# Altium schematic sheet SX1255.SchDoc: SX1255
size A4; CompanyName: WiSE Lab; Engineer: Anh Luong; Organization: Carnegie Mellon University; Address1: 4720 Forbes Ave; Address2: CIC 2219F; Address3: Pittsburgh, PA 15213; Address4: USA; Revision: 1; SheetNumber: 3; SheetTotal: 4
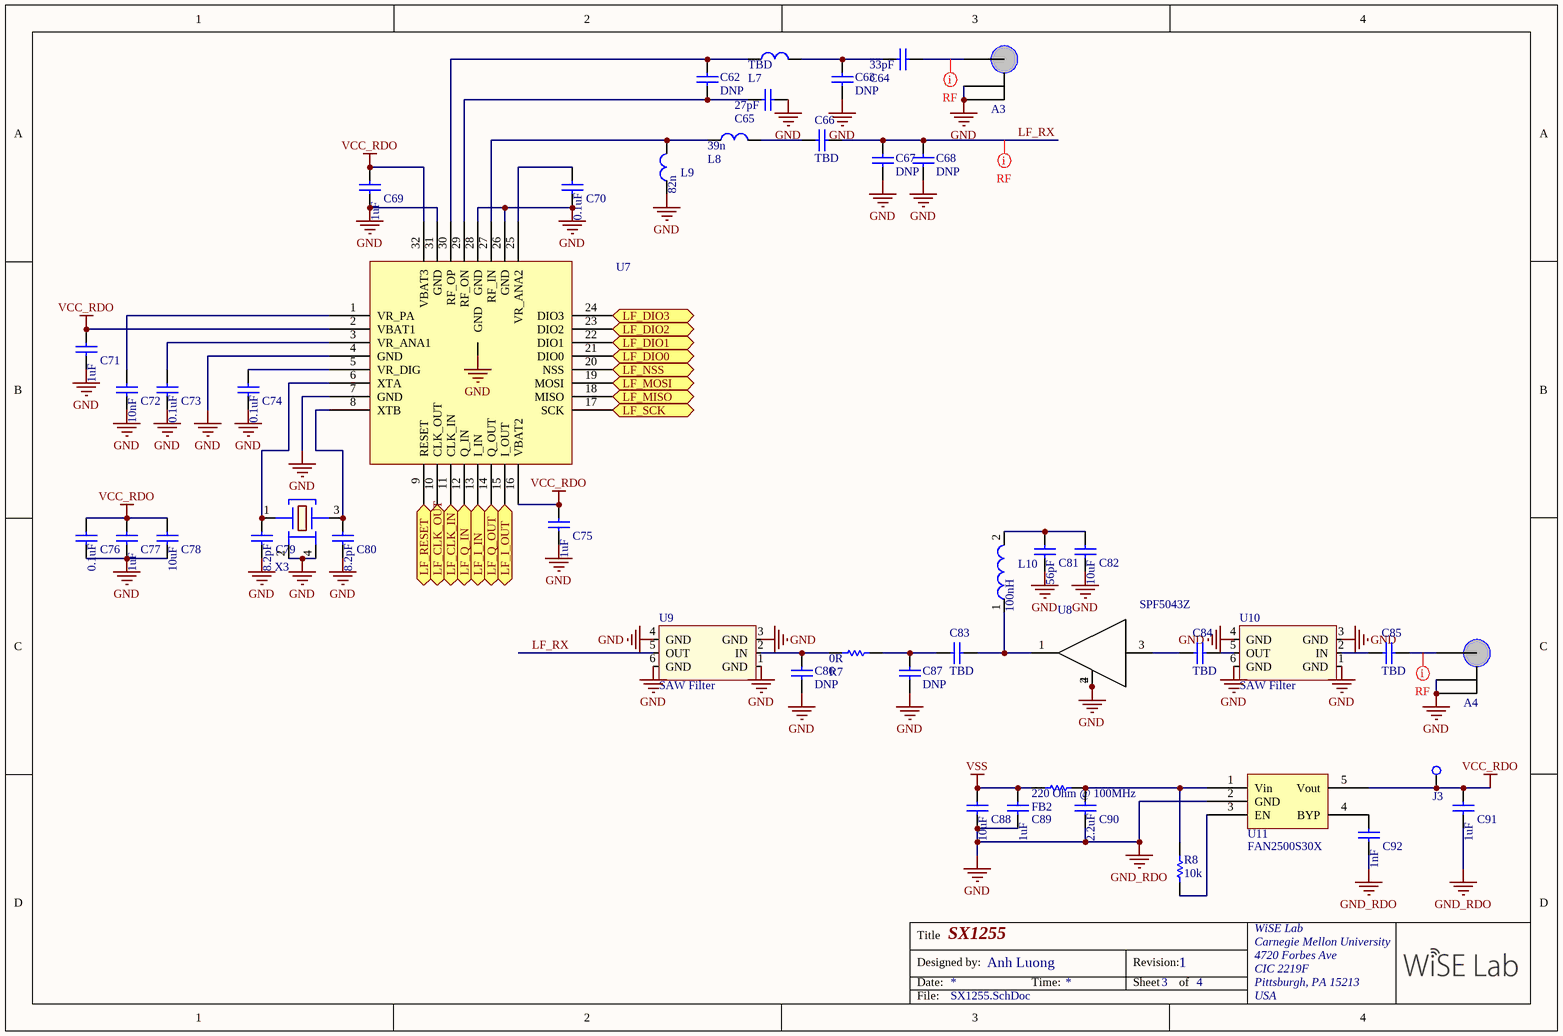
[diagram p0: SX1255.SchDoc]

## Parts
A3  U.FL-R-SMT(01)  [U.FL-R-SMT-1]  (value not drawn)
A4  U.FL-R-SMT(01)  [U.FL-R-SMT-1]  (value not drawn)
C62  value DNP  [CAPC1005X04L]  (hidden comment: C_DNP)
C63  value DNP  [CAPC1005X04L]  (hidden comment: C_DNP)
C64  GRM1555C1H330JA01D  [CAPC1005X04L]  (value not drawn)
C65  GRM1555C1H270JA01J  [CAPC1005X04L]  (value not drawn)
C66  value TBD  [CAPC1005X04L]  (hidden comment: C_TBD)
C67  value DNP  [CAPC1005X04L]  (hidden comment: C_DNP)
C68  value DNP  [CAPC1005X04L]  (hidden comment: C_DNP)
C69  GRM155R60J105KE19D  [CAPC1005X04L]  (value not drawn)
C70  GRM155R71C104KA88D  [CAPC1005X04L]  (value not drawn)
C71  GRM155R60J105KE19D  [CAPC1005X04L]  (value not drawn)
C72  GRM155R71E103KA01D  [CAPC1005X04L]  (value not drawn)
C73  GRM155R71C104KA88D  [CAPC1005X04L]  (value not drawn)
C74  GRM155R71C104KA88D  [CAPC1005X04L]  (value not drawn)
C75  GRM155R60J105KE19D  [CAPC1005X04L]  (value not drawn)
C76  GRM155R71C104KA88D  [CAPC1005X04L]  (value not drawn)
C77  GRM155R60J105KE19D  [CAPC1005X04L]  (value not drawn)
C78  GRM155R60J106ME15D  [INDC1005X04L]  (value not drawn)
C79  GRM1555C1H8R2CA01D  [CAPC1005X04L]  (value not drawn)
C80  GRM1555C1H8R2CA01D  [CAPC1005X04L]  (value not drawn)
C81  GRM1555C1H560JA01D  [CAPC1005X04L]  (value not drawn)
C82  GRM155R60J106ME15D  [INDC1005X04L]  (value not drawn)
C83  value TBD  [CAPC1005X04L]  (hidden comment: C_TBD)
C84  value TBD  [CAPC1005X04L]  (hidden comment: C_TBD)
C85  value TBD  [CAPC1005X04L]  (hidden comment: C_TBD)
C86  value DNP  [CAPC1005X04L]  (hidden comment: C_DNP)
C87  value DNP  [CAPC1005X04L]  (hidden comment: C_DNP)
C88  GRM188C81C106MA73D  [CAPC1608X08N (0603)]  (value not drawn)
C89  GRM188R61A105KA61D  [CAPC1608X08N (0603)]  (value not drawn)
C90  GRM188R60J225KE19D  [CAPC1608X08N (0603)]  (value not drawn)
C91  GRM188R61A105KA61D  [CAPC1608X08N (0603)]  (value not drawn)
C92  GRM1885C1H102JA01D  [CAPC1608X08N (0603)]  (value not drawn)
FB2  BLM18BD221SN1D  [RESC1608X06N (0603)]  (value not drawn)
J3  5004  [TP]  (value not drawn)
L7  L_TBD  [INDC1005X04L]  (value not drawn)
L8  LQG15HS39NJ02D  [INDC1005X04L]  (value not drawn)
L9  LQG15HS82NJ02D  [INDC1005X04L]  (value not drawn)
L10  LQG15HSR10J02D  [INDC1005X04L]  (value not drawn)
R7  PMR01ZZPJ000  [RESC1005X04N]  (value not drawn)
R8  value 10k  [RESC1608X06N (0603)]  (hidden comment: MCR03ERTF1002)
U7  SX1257IWLTRT  [QFN50P500X500X80_HS-33N]  (value not drawn)
U8  SPF5043Z  [SOT-343]
U9  SAW Filter  [DCC6C_3.0x3.0mm]
U10  SAW Filter  [DCC6C_3.0x3.0mm]
U11  FAN2500S30X  [SOT95P280X145-5N]
X3  ABM11-36.000MHZ-D2X-T3  [2.0x1.6x0.59mmXTAL]  (value not drawn)

## Ports
LF_CLK_IN, LF_CLK_OUT, LF_DIO0, LF_DIO1, LF_DIO2, LF_DIO3, LF_I_IN, LF_I_OUT, LF_MISO, LF_MOSI, LF_NSS, LF_Q_IN, LF_Q_OUT, LF_RESET, LF_SCK

## Nets
GND: A3.2 A3.3 A4.2 A4.3 C63.1 C65.2 C67.1 C68.1 C69.1 C70.1 C71.1 C72.1 C73.1 C74.1 C75.1 C76.1 C77.1 C78.1 C79.1 C80.1 C81.1 C82.1 C86.1 C87.1 C88.1 C89.1 C90.1 C91.1 C92.1 L9.1 U7.4(GND) U7.7(GND) U7.26(GND) U7.28(GND) U7.31(GND) U7.33(GND) U8.2(GND1) U8.4(GND2) U9.1(GND) U9.3(GND) U9.4(GND) U9.6(GND) U10.1(GND) U10.3(GND) U10.4(GND) U10.6(GND) U11.2(GND) X3.2 X3.4  [also labelled GND_RDO]
VCC_RDO: C69.2 C71.2 C75.2 C76.2 C77.2 C78.2 C91.2 J3.1 U7.2(VBAT1) U7.16(VBAT2) U7.32(VBAT3) U11.5(Vout)
VSS: C88.2 C89.2 FB2.1
LF_CLK_IN: U7.11(CLK_IN) ; port LF_CLK_IN
LF_CLK_OUT: U7.10(CLK_OUT) ; port LF_CLK_OUT
LF_DIO0: U7.21(DIO0) ; port LF_DIO0
LF_DIO1: U7.22(DIO1) ; port LF_DIO1
LF_DIO2: U7.23(DIO2) ; port LF_DIO2
LF_DIO3: U7.24(DIO3) ; port LF_DIO3
LF_I_IN: U7.13(I_IN) ; port LF_I_IN
LF_I_OUT: U7.15(I_OUT) ; port LF_I_OUT
LF_MISO: U7.18(MISO) ; port LF_MISO
LF_MOSI: U7.19(MOSI) ; port LF_MOSI
LF_NSS: U7.20(NSS) ; port LF_NSS
LF_Q_IN: U7.12(Q_IN) ; port LF_Q_IN
LF_Q_OUT: U7.14(Q_OUT) ; port LF_Q_OUT
LF_RESET: U7.9(RESET) ; port LF_RESET
LF_RX: C66.2 C67.2 C68.2 U9.5(OUT)
LF_SCK: U7.17(SCK) ; port LF_SCK
NetA3_1: A3.1 C64.2
NetA4_1: A4.1 C85.2
NetC62_1: C62.1 C65.1 U7.29(RF_ON)
NetC62_2: C62.2 L7.1 U7.30(RF_OP)
NetC63_2: C63.2 C64.1 L7.2
NetC66_1: C66.1 L8.2
NetC70_2: C70.2 U7.25(VR_ANA2)
NetC72_2: C72.2 U7.1(VR_PA)
NetC73_2: C73.2 U7.3(VR_ANA1)
NetC74_2: C74.2 U7.5(VR_DIG)
NetC79_2: C79.2 U7.6(XTA) X3.1
NetC80_2: C80.2 U7.8(XTB) X3.3
NetC81_2: C81.2 C82.2 L10.2
NetC83_1: C83.1 C87.2 R7.2
NetC83_2: C83.2 L10.1 U8.1(OUT)
NetC84_1: C84.1 U8.3(IN)
NetC84_2: C84.2 U10.5(OUT)
NetC85_1: C85.1 U10.2(IN)
NetC86_2: C86.2 R7.1 U9.2(IN)
NetC90_2: C90.2 FB2.2 R8.2 U11.1(Vin)
NetC92_2: C92.2 U11.4(BYP)
NetL8_1: L8.1 L9.2 U7.27(RF_IN)
NetR8_1: R8.1 U11.3(EN)

## Layout directives
net class RF: LF_RX, NetA3_1, NetA4_1

## Notes on the sheet
- Title
- Designed by:
- Date:
- Time:
- Revision:
- Sheet
- of
- File:
- (in symbol GRM155R60J105KE19D) 1uF
- (in symbol GRM155R60J106ME15D) 10uF
- (in symbol GRM155R71C104KA88D) 0.1uF
- (in symbol GRM155R71E103KA01D) 10nF
- (in symbol GRM188C81C106MA73D) 10uF
- (in symbol GRM188R60J225KE19D) 2.2uF
- (in symbol GRM188R61A105KA61D) 1uF
- (in symbol GRM1555C1H8R2CA01D) 8.2pF
- (in symbol GRM1555C1H270JA01J) 27pF
- (in symbol GRM1555C1H330JA01D) 33pF
- (in symbol GRM1555C1H560JA01D) 56pF
- (in symbol GRM1885C1H102JA01D) 1nF
- (in symbol L_TBD) TBD
- (in symbol LQG15HS39NJ02D) 39n
- (in symbol LQG15HS82NJ02D) 82n
- (in symbol LQG15HSR10J02D) 100nH
- (in symbol PMR01ZZPJ000) 0R

## Library data of the parts
A3 A4 = U.FL-R-SMT(01): CONN UMC JACK STR 50 OHM SMD; Manufacturer: Hirose Electric Co Ltd; Connector Style: Ultra Miniature Coaxial; Connector Type: Jack, Male Pin; Contact Termination: Solder; Impedance: 50 Ohm; Frequency - Max: 6GHz; Body Material: Phosphor Bronze; Body Finish: Silver; Center Contact Plating: Gold; Dielectric Material: Liquid Crystal Polymer (LCP); Supplier 1: Digi-Key; Manufacturer Part Number: U.FL-R-SMT(01); RoHS: RoHS Compliant; Category: Connectors, Interconnects; Stock 1: 22286; Pricing 1: 1=1.28, 10=1.122, 25=1.056, 50=1.012, 100=0.968, 250=0.88, 500=0.792, 1000=0.704, 2500=0.638 (USD); Packaging: Bulk; Shield Termination: Solder; Mounting Type: Surface Mount; Cable Group: -; Fastening Type: Snap-On; Features: -; Housing Color: Silver; Ingress Protection: -; Center Contact Material: Phosphor Bronze; Voltage Rating: -; Operating Temperature: -40°C ~ 90°C; ComponentLink1URL: http://www.hirose.co.jp/cataloge_hp/e32119372.pdf; ComponentLink1Description: http://www.hirose.co.jp/cataloge_hp/e32119372.pdf
C64 = GRM1555C1H330JA01D: CAP CER 33PF 50V C0G/NP0 0402; Manufacturer: Murata Electronics North America; Tolerance: ±5%; Temperature Coefficient: C0G, NP0; Supplier 1: Digi-Key; Manufacturer Part Number: GRM1555C1H330JA01D; RoHS: RoHS Compliant; Category: Capacitors; Stock 1: 295196; Pricing 1: 1=0.1, 10=0.015, 100=0.0067, 500=0.00478, 1000=0.00375, 2500=0.00341, 5000=0.00314 (USD); Packaging: Cut Tape (CT); Part Status: Active; Voltage - Rated: 50V; Operating Temperature: -55°C ~ 125°C; Features: -; Ratings: -; Applications: General Purpose; Mounting Type: Surface Mount, MLCC; Package / Case: 0402 (1005 Metric); Size / Dimension: 0.039" L x 0.020" W (1.00mm x 0.50mm); Height - Seated (Max): -; Thickness (Max): 0.022" (0.55mm); Lead Spacing: -; Lead Style: -; ComponentLink1URL: http://www.murata.com/~/media/webrenewal/support/library/catalog/products/capacitor/mlcc/c02e.pdf; ComponentLink1Description: http://www.murata.com/~/media/webrenewal/support/library/catalog/products/capacitor/mlcc/c02e.pdf; Supplier Part Number 1: 490-5936-1-ND
C65 = GRM1555C1H270JA01J: CAP CER 27PF 50V C0G/NP0 0402; Manufacturer: Murata Electronics North America; Tolerance: ±5%; Temperature Coefficient: C0G, NP0; Supplier 1: Digi-Key; Manufacturer Part Number: GRM1555C1H270JA01J; RoHS: RoHS Compliant; Category: Capacitors; Stock 1: 98162; Pricing 1: 1=0.1, 10=0.022, 100=0.0098, 500=0.00696, 1000=0.00548, 2500=0.00498, 5000=0.00458 (USD); Packaging: Cut Tape (CT); Part Status: Active; Voltage - Rated: 50V; Operating Temperature: -55°C ~ 125°C; Features: -; Ratings: -; Applications: General Purpose; Mounting Type: Surface Mount, MLCC; Package / Case: 0402 (1005 Metric); Size / Dimension: 0.039" L x 0.020" W (1.00mm x 0.50mm); Height - Seated (Max): -; Thickness (Max): 0.022" (0.55mm); Lead Spacing: -; Lead Style: -; ComponentLink1URL: http://www.murata.com/~/media/webrenewal/support/library/catalog/products/capacitor/mlcc/c02e.pdf; ComponentLink1Description: http://www.murata.com/~/media/webrenewal/support/library/catalog/products/capacitor/mlcc/c02e.pdf; Supplier Part Number 1: 490-11384-1-ND
C69 C71 C75 C77 = GRM155R60J105KE19D: CAP CER 1UF 6.3V X5R 0402; Manufacturer: Murata Electronics North America; Tolerance: ±10%; Supplier 1: Digi-Key; Manufacturer Part Number: GRM155R60J105KE19D; RoHS: RoHS Compliant; Category: Capacitors; Stock 1: 2790642; Pricing 1: 1=0.1, 10=0.024, 100=0.0108, 500=0.0077, 1000=0.00605, 2500=0.0055, 5000=0.00506 (USD); Packaging: Cut Tape (CT); Part Status: Active; Voltage - Rated: 6.3V; Temperature Coefficient: X5R; Operating Temperature: -55°C ~ 85°C; Features: -; Ratings: -; Applications: General Purpose; Mounting Type: Surface Mount, MLCC; Package / Case: 0402 (1005 Metric); Size / Dimension: 0.039" L x 0.020" W (1.00mm x 0.50mm); Height - Seated (Max): -; Thickness (Max): 0.022" (0.55mm); Lead Spacing: -; Lead Style: -; ComponentLink1URL: http://www.murata.com/~/media/webrenewal/support/library/catalog/products/capacitor/mlcc/c02e.pdf; ComponentLink1Description: http://www.murata.com/~/media/webrenewal/support/library/catalog/products/capacitor/mlcc/c02e.pdf; Supplier Part Number 1: 490-1320-1-ND
C70 C73 C74 C76 = GRM155R71C104KA88D: CAP CER 0.1UF 16V X7R 0402; Manufacturer: Murata Electronics North America; Tolerance: ±10%; Supplier 1: Digi-Key; Manufacturer Part Number: GRM155R71C104KA88D; RoHS: RoHS Compliant; Category: Capacitors; Stock 1: 38255872; Pricing 1: 1=0.1, 10=0.014, 100=0.0062, 500=0.00442, 1000=0.00348, 2500=0.00316, 5000=0.00291 (USD); Packaging: Cut Tape (CT); Part Status: Active; Voltage - Rated: 16V; Temperature Coefficient: X7R; Operating Temperature: -55°C ~ 125°C; Features: -; Ratings: -; Applications: General Purpose; Mounting Type: Surface Mount, MLCC; Package / Case: 0402 (1005 Metric); Size / Dimension: 0.039" L x 0.020" W (1.00mm x 0.50mm); Height - Seated (Max): -; Thickness (Max): 0.022" (0.55mm); Lead Spacing: -; Lead Style: -; ComponentLink1URL: http://www.murata.com/~/media/webrenewal/support/library/catalog/products/capacitor/mlcc/c02e.pdf; ComponentLink1Description: http://www.murata.com/~/media/webrenewal/support/library/catalog/products/capacitor/mlcc/c02e.pdf; Supplier Part Number 1: 490-3261-1-ND
C72 = GRM155R71E103KA01D: CAP CER 10000PF 25V X7R 0402; Manufacturer: Murata Electronics North America; Tolerance: ±10%; Supplier 1: Digi-Key; Manufacturer Part Number: GRM155R71E103KA01D; RoHS: RoHS Compliant; Category: Capacitors; Stock 1: 8083248; Pricing 1: 1=0.1, 10=0.013, 100=0.0056, 500=0.004, 1000=0.00315, 2500=0.00286, 5000=0.00263 (USD); Packaging: Cut Tape (CT); Part Status: Active; Voltage - Rated: 25V; Temperature Coefficient: X7R; Operating Temperature: -55°C ~ 125°C; Features: -; Ratings: -; Applications: General Purpose; Mounting Type: Surface Mount, MLCC; Package / Case: 0402 (1005 Metric); Size / Dimension: 0.039" L x 0.020" W (1.00mm x 0.50mm); Height - Seated (Max): -; Thickness (Max): 0.022" (0.55mm); Lead Spacing: -; Lead Style: -; ComponentLink1URL: http://www.murata.com/~/media/webrenewal/support/library/catalog/products/capacitor/mlcc/c02e.pdf; ComponentLink1Description: http://www.murata.com/~/media/webrenewal/support/library/catalog/products/capacitor/mlcc/c02e.pdf; Supplier Part Number 1: 490-1312-1-ND
C78 C82 = GRM155R60J106ME15D: CAP CER 10UF 6.3V X5R 0402; Manufacturer: Murata Electronics North America; Tolerance: ±20%; Supplier 1: Digi-Key; Manufacturer Part Number: GRM155R60J106ME15D; RoHS: RoHS Compliant; Category: Capacitors; Stock 1: 183912; Pricing 1: 1=0.24, 10=0.16, 100=0.0813, 500=0.0556, 1000=0.04918, 2500=0.04704, 5000=0.04277 (USD); Packaging: Cut Tape (CT); Part Status: Active; Voltage - Rated: 6.3V; Temperature Coefficient: X5R; Operating Temperature: -55°C ~ 85°C; Features: Derating Recommended; Ratings: -; Applications: General Purpose; Mounting Type: Surface Mount, MLCC; Package / Case: 0402 (1005 Metric); Size / Dimension: 0.039" L x 0.020" W (1.00mm x 0.50mm); Height - Seated (Max): -; Thickness (Max): 0.026" (0.65mm); Lead Spacing: -; Lead Style: -; ComponentLink1URL: http://www.murata.com/~/media/webrenewal/support/library/catalog/products/capacitor/mlcc/c02e.pdf; ComponentLink1Description: http://www.murata.com/~/media/webrenewal/support/library/catalog/products/capacitor/mlcc/c02e.pdf; Supplier Part Number 1: 490-13238-1-ND
C79 C80 = GRM1555C1H8R2CA01D: CAP CER 8.2PF 50V C0G/NP0 0402; Manufacturer: Murata Electronics North America; Tolerance: ±0.25pF; Temperature Coefficient: C0G, NP0; Supplier 1: Digi-Key; Manufacturer Part Number: GRM1555C1H8R2CA01D; RoHS: RoHS Compliant; Category: Capacitors; Stock 1: 757168; Pricing 1: 1=0.1, 10=0.032, 100=0.0143, 500=0.0102, 1000=0.00802, 2500=0.00729, 5000=0.0067 (USD); Packaging: Cut Tape (CT); Part Status: Active; Voltage - Rated: 50V; Operating Temperature: -55°C ~ 125°C; Features: -; Ratings: -; Applications: General Purpose; Mounting Type: Surface Mount, MLCC; Package / Case: 0402 (1005 Metric); Size / Dimension: 0.039" L x 0.020" W (1.00mm x 0.50mm); Height - Seated (Max): -; Thickness (Max): 0.022" (0.55mm); Lead Spacing: -; Lead Style: -; ComponentLink1URL: http://www.murata.com/~/media/webrenewal/support/library/catalog/products/capacitor/mlcc/c02e.pdf; ComponentLink1Description: http://www.murata.com/~/media/webrenewal/support/library/catalog/products/capacitor/mlcc/c02e.pdf; Supplier Part Number 1: 490-6256-1-ND
C81 = GRM1555C1H560JA01D: CAP CER 56PF 50V C0G/NP0 0402; Manufacturer: Murata Electronics North America; Tolerance: ±5%; Temperature Coefficient: C0G, NP0; Supplier 1: Digi-Key; Manufacturer Part Number: GRM1555C1H560JA01D; RoHS: RoHS Compliant; Category: Capacitors; Stock 1: 623532; Pricing 1: 1=0.1, 10=0.014, 100=0.0062, 500=0.00442, 1000=0.00348, 2500=0.00316, 5000=0.00291 (USD); Packaging: Cut Tape (CT); Part Status: Active; Voltage - Rated: 50V; Operating Temperature: -55°C ~ 125°C; Features: -; Ratings: -; Applications: General Purpose; Mounting Type: Surface Mount, MLCC; Package / Case: 0402 (1005 Metric); Size / Dimension: 0.039" L x 0.020" W (1.00mm x 0.50mm); Height - Seated (Max): -; Thickness (Max): 0.022" (0.55mm); Lead Spacing: -; Lead Style: -; ComponentLink1URL: http://www.murata.com/~/media/webrenewal/support/library/catalog/products/capacitor/mlcc/c02e.ashx?la=en-us; ComponentLink1Description: http://www.murata.com/~/media/webrenewal/support/library/catalog/products/capacitor/mlcc/c02e.ashx?la=en-us; Supplier Part Number 1: 490-1288-1-ND
C88 = GRM188C81C106MA73D: CAP CER 10UF 16V 20% X6S 0603; Manufacturer: Murata Electronics North America; Capacitance: 10µF; Supplier 1: Digi-Key; Manufacturer Part Number: GRM188C81C106MA73D; RoHS: RoHS Compliant; Category: Capacitors; Stock 1: 59274; Pricing 1: 1=0.4, 10=0.349, 50=0.2118, 100=0.1744, 250=0.13952, 500=0.12708, 1000=0.11237 (USD); Packaging: Cut Tape (CT); Voltage - Rated: 16V; Tolerance: ±20%; Temperature Coefficient: X6S; Mounting Type: Surface Mount, MLCC; Operating Temperature: -55°C ~ 105°C; Applications: General Purpose; Ratings: -; Package / Case: 0603 (1608 Metric); Size / Dimension: 0.063" L x 0.031" W (1.60mm x 0.80mm); Height - Seated (Max): -; Thickness (Max): 0.031" (0.80mm); Lead Spacing: -; Features: -; Lead Style: -; ComponentLink1URL: http://www.murata.com/products/catalog/pdf/c02e.pdf; ComponentLink1Description: http://www.murata.com/products/catalog/pdf/c02e.pdf
C89 C91 = GRM188R61A105KA61D: CAP CER 1UF 10V 10% X5R 0603; Manufacturer: Murata Electronics North America; Capacitance: 1.0µF; Supplier 1: Digi-Key; Manufacturer Part Number: GRM188R61A105KA61D; RoHS: RoHS Compliant; Category: Capacitors; Stock 1: 244919; Pricing 1: 1=0.1, 10=0.041, 50=0.0224, 100=0.019, 250=0.01552, 500=0.01328, 1000=0.01035 (USD); Packaging: Cut Tape (CT); Voltage - Rated: 10V; Tolerance: ±10%; Temperature Coefficient: X5R; Mounting Type: Surface Mount, MLCC; Operating Temperature: -55°C ~ 85°C; Applications: General Purpose; Ratings: -; Package / Case: 0603 (1608 Metric); Size / Dimension: 0.063" L x 0.031" W (1.60mm x 0.80mm); Height - Seated (Max): -; Thickness (Max): 0.035" (0.90mm); Lead Spacing: -; Features: -; Lead Style: -; ComponentLink1URL: http://search.murata.co.jp/Ceramy/image/img/A01X/G101/ENG/GRM188R61A105KA61-01.pdf; ComponentLink1Description: http://search.murata.co.jp/Ceramy/image/img/A01X/G101/ENG/GRM188R61A105KA61-01.pdf
C90 = GRM188R60J225KE19D: CAP CER 2.2UF 6.3V 10% X5R 0603; Manufacturer: Murata Electronics North America; Capacitance: 2.2µF; Supplier 1: Digi-Key; Manufacturer Part Number: GRM188R60J225KE19D; RoHS: RoHS Compliant; Category: Capacitors; Stock 1: 155330; Pricing 1: 1=0.17, 10=0.114, 50=0.0658, 100=0.0543, 250=0.04572, 500=0.0383, 1000=0.03143 (USD); Packaging: Cut Tape (CT); Voltage - Rated: 6.3V; Tolerance: ±10%; Temperature Coefficient: X5R; Mounting Type: Surface Mount, MLCC; Operating Temperature: -55°C ~ 85°C; Applications: General Purpose; Ratings: -; Package / Case: 0603 (1608 Metric); Size / Dimension: 0.063" L x 0.031" W (1.60mm x 0.80mm); Height - Seated (Max): -; Thickness (Max): 0.035" (0.90mm); Lead Spacing: -; Features: -; Lead Style: -; ComponentLink1URL: http://search.murata.co.jp/Ceramy/image/img/A01X/G101/ENG/GRM188R60J225KE19-01.pdf; ComponentLink1Description: http://search.murata.co.jp/Ceramy/image/img/A01X/G101/ENG/GRM188R60J225KE19-01.pdf
C92 = GRM1885C1H102JA01D: CAP CER 1000PF 50V 5% NP0 0603; Manufacturer: Murata Electronics North America; Temperature Coefficient: C0G, NP0; Supplier 1: Digi-Key; Manufacturer Part Number: GRM1885C1H102JA01D; RoHS: RoHS Compliant; Category: Capacitors; Stock 1: 140000; Pricing 1: 4000=0.00863, 8000=0.00788, 12000=0.0075, 28000=0.00713, 100000=0.00516 (USD); Packaging: Tape & Reel (TR); Capacitance: 1000pF; Voltage - Rated: 50V; Tolerance: ±5%; Mounting Type: Surface Mount, MLCC; Operating Temperature: -55°C ~ 125°C; Applications: General Purpose; Ratings: -; Package / Case: 0603 (1608 Metric); Size / Dimension: 0.063" L x 0.031" W (1.60mm x 0.80mm); Height - Seated (Max): -; Thickness (Max): 0.035" (0.90mm); Lead Spacing: -; Features: -; Lead Style: -; ComponentLink1URL: http://www.murata.com/products/catalog/pdf/c02e.pdf; ComponentLink1Description: http://www.murata.com/products/catalog/pdf/c02e.pdf
FB2 = BLM18BD221SN1D: FERRITE CHIP 220 OHM 200MA 0603; Manufacturer: Murata Electronics North America; Impedance @ Frequency: 220 Ohm @ 100MHz; DC Resistance (DCR): 450 mOhm Max; Filter Type: Differential Mode - Single; Supplier 1: Digi-Key; Manufacturer Part Number: BLM18BD221SN1D; RoHS: RoHS Compliant; Category: Filters; Stock 1: 35645; Pricing 1: 1=0.1, 10=0.087, 50=0.0712, 100=0.0523, 250=0.038, 500=0.03484, 1000=0.0301 (USD); Packaging: Cut Tape (CT); Current Rating: 200mA; Package / Case: 0603 (1608 Metric); Mounting Type: Surface Mount; Height (Max): 0.037" (0.95mm); Size / Dimension: 0.063" L x 0.031" W (1.60mm x 0.80mm); ComponentLink1URL: http://search.murata.co.jp/Ceramy/image/img/PDF/ENG/L0110S0100BLM18B.pdf; ComponentLink1Description: http://search.murata.co.jp/Ceramy/image/img/PDF/ENG/L0110S0100BLM18B.pdf
J3 = 5004: TEST POINT PC MINI .040"D YELLOW; Manufacturer: Keystone Electronics; Supplier 1: Digi-Key; Manufacturer Part Number: 5004; RoHS: RoHS Compliant; Category: Test and Measurement; Stock 1: 45761; Pricing 1: 1=0.34, 10=0.318, 50=0.232, 100=0.2228, 250=0.20008, 500=0.191, 1000=0.15916, 2500=0.14552, 5000=0.13643 (USD); Packaging: Bulk; Type: PC Test Point, Miniature; Terminal: 0.010" x 0.020" (0.25mm x 0.51mm) Phosphor Bronze Wire, Silver Plated; Mounting Type: 0.040" (1.02mm) Hole Diameter; Material: Base, Nylon 46, UL 94V-0; Color: Yellow; ComponentLink1URL: http://www.keyelco.com/product-pdf.cfm?p=1313; ComponentLink1Description: http://www.keyelco.com/product-pdf.cfm?p=1313
L8 = LQG15HS39NJ02D: FIXED IND 39NH 300MA 650 MOHM; Manufacturer: Murata Electronics North America; Type: Multilayer; Tolerance: ±5%; Shielding: Unshielded; DC Resistance (DCR): 650 mOhm Max; Q @ Freq: 8 @ 100MHz; Supplier 1: Digi-Key; Manufacturer Part Number: LQG15HS39NJ02D; RoHS: RoHS Compliant; Category: Inductors, Coils, Chokes; Stock 1: 33416; Pricing 1: 1=0.1, 10=0.066, 100=0.0442, 500=0.0368, 1000=0.03091, 2500=0.0265 (USD); Packaging: Cut Tape (CT); Part Status: Active; Material - Core: -; Ratings: -; Operating Temperature: -55°C ~ 125°C; Mounting Type: Surface Mount; Package / Case: 0402 (1005 Metric); Supplier Device Package: 0402 (1005 Metric); Size / Dimension: 0.039" L x 0.020" W (1.00mm x 0.50mm); Height - Seated (Max): 0.022" (0.55mm); ComponentLink1URL: http://search.murata.co.jp/Ceramy/image/img/P02/JELF243B-0010.pdf; ComponentLink1Description: http://search.murata.co.jp/Ceramy/image/img/P02/JELF243B-0010.pdf; Supplier Part Number 1: 490-2630-1-ND
L9 = LQG15HS82NJ02D: FIXED IND 82NH 200MA 1.2 OHM SMD; Manufacturer: Murata Electronics North America; Type: Multilayer; Tolerance: ±5%; Shielding: Unshielded; DC Resistance (DCR): 1.2 Ohm Max; Q @ Freq: 8 @ 100MHz; Supplier 1: Digi-Key; Manufacturer Part Number: LQG15HS82NJ02D; RoHS: RoHS Compliant; Category: Inductors, Coils, Chokes; Stock 1: 68942; Pricing 1: 1=0.1, 10=0.071, 100=0.0476, 500=0.03968, 1000=0.03333, 2500=0.02857 (USD); Packaging: Cut Tape (CT); Part Status: Active; Material - Core: -; Ratings: -; Operating Temperature: -55°C ~ 125°C; Mounting Type: Surface Mount; Package / Case: 0402 (1005 Metric); Supplier Device Package: 0402 (1005 Metric); Size / Dimension: 0.039" L x 0.020" W (1.00mm x 0.50mm); Height - Seated (Max): 0.022" (0.55mm); ComponentLink1URL: http://search.murata.co.jp/Ceramy/image/img/P02/JELF243B-0010.pdf; ComponentLink1Description: http://search.murata.co.jp/Ceramy/image/img/P02/JELF243B-0010.pdf; Supplier Part Number 1: 490-2634-1-ND
L10 = LQG15HSR10J02D: FIXED IND 100NH 200MA 1.25 OHM; Manufacturer: Murata Electronics North America; Type: Multilayer; Tolerance: ±5%; Shielding: Unshielded; DC Resistance (DCR): 1.25 Ohm Max; Q @ Freq: 8 @ 100MHz; Supplier 1: Digi-Key; Manufacturer Part Number: LQG15HSR10J02D; RoHS: RoHS Compliant; Category: Inductors, Coils, Chokes; Stock 1: 86447; Pricing 1: 1=0.1, 10=0.071, 100=0.0476, 500=0.03968, 1000=0.03333, 2500=0.02857 (USD); Packaging: Cut Tape (CT); Part Status: Active; Material - Core: -; Ratings: -; Operating Temperature: -55°C ~ 125°C; Mounting Type: Surface Mount; Package / Case: 0402 (1005 Metric); Supplier Device Package: 0402 (1005 Metric); Size / Dimension: 0.039" L x 0.020" W (1.00mm x 0.50mm); Height - Seated (Max): 0.022" (0.55mm); ComponentLink1URL: http://search.murata.co.jp/Ceramy/image/img/P02/JELF243B-0010.pdf; ComponentLink1Description: http://search.murata.co.jp/Ceramy/image/img/P02/JELF243B-0010.pdf; Supplier Part Number 1: 490-2635-1-ND
R7 = PMR01ZZPJ000: RES SMD 0 OHM JUMPER 1/5W 0402; Manufacturer: Rohm Semiconductor; Power (Watts): 0.2W, 1/5W; Temperature Coefficient: 0/ +200ppm/°C; Supplier 1: Digi-Key; Manufacturer Part Number: PMR01ZZPJ000; RoHS: RoHS Compliant; Category: Resistors; Stock 1: 89225; Pricing 1: 1=1.17, 10=1.016, 25=0.8932, 50=0.8162, 100=0.7084, 250=0.616, 500=0.51128, 1000=0.4158, 5000=0.3967 (USD); Packaging: Cut Tape (CT); Part Status: Active; Tolerance: Jumper; Composition: Thick Film; Features: Automotive AEC-Q200, Current Sense; Operating Temperature: -55°C ~ 155°C; Package / Case: 0402 (1005 Metric); Supplier Device Package: 0402; Size / Dimension: 0.039" L x 0.020" W (1.00mm x 0.50mm); Height - Seated (Max): 0.014" (0.35mm); Failure Rate: -; ComponentLink1URL: http://www.rohm.com/web/global/datasheet/PMR01ZZPJ000/pmr-jpw-e; ComponentLink1Description: http://www.rohm.com/web/global/datasheet/PMR01ZZPJ000/pmr-jpw-e; Supplier Part Number 1: RHM1692-1-ND
R8 = MCR03ERTF1002: RES SMD 10K OHM 1% 1/10W 0603; Manufacturer: Rohm Semiconductor; Power (Watts): 0.1W, 1/10W; Temperature Coefficient: ±100ppm/°C; Supplier 1: Digi-Key; Manufacturer Part Number: MCR03ERTF1002; RoHS: RoHS Compliant; Category: Resistors; Stock 1: 30590; Pricing 1: 1=0.1, 10=0.022, 25=0.016, 100=0.0089, 250=0.0068, 500=0.00542, 1000=0.00399 (USD); Packaging: Digi-Reel®; Resistance (Ohms): 10k; Tolerance: ±1%; Composition: Thick Film; Features: -; Package / Case: 0603 (1608 Metric); Supplier Device Package: 0603 (1608 Metric); Size / Dimension: 0.063" L x 0.031" W (1.60mm x 0.80mm); Height: 0.022" (0.55mm); Number of Terminations: 2; ComponentLink1URL: http://rohmfs.rohm.com/en/products/databook/datasheet/passive/resistor/chip_resistor/mcr_g.pdf; ComponentLink1Description: http://rohmfs.rohm.com/en/products/databook/datasheet/passive/resistor/chip_resistor/mcr_g.pdf; Operating Temperature: -55°C ~ 155°C; Supplier Part Number 1: RHM10.0KCFDKR-ND
U7 = SX1257IWLTRT: IC RF TXRX 802.15.4 32WFQFN; Manufacturer: Semtech Corporation; Modulation: FHSS, FSK, OFDM, O-QPSK; Frequency: 862Mhz ~ 1.02GHz; Power - Output: 8dBm; Serial Interfaces: SPI; Voltage - Supply: 2.7 V ~ 3.6 V; Current - Receiving: 20mA; Current - Transmitting: 58mA; Supplier 1: Digi-Key; Manufacturer Part Number: SX1257IWLTRT; RoHS: RoHS Compliant; Category: RF/IF and RFID; Stock 1: 3538; Pricing 1: 1=7.56, 10=6.93, 25=6.3, 100=5.67, 250=5.19752, 500=4.725, 1000=4.2525 (USD); Packaging: Cut Tape (CT); Part Status: Active; Type: TxRx Only; RF Family/Standard: 802.15.4; Protocol: -; Data Rate (Max): -; Sensitivity: -; Memory Size: -; Operating Temperature: -40°C ~ 85°C; Package / Case: 32-WFQFN Exposed Pad; ComponentLink1URL: http://www.semtech.com/images/datasheet/sx1257.pdf; ComponentLink1Description: http://www.semtech.com/images/datasheet/sx1257.pdf; Supplier Part Number 1: SX1257IWLTRTCT-ND
U8 = SPF5043Z: SPF5043Z; Low Noise Amplifier; RFMD; Frequency: 50MHz ~ 4GHz; P1dB: 22.7dB; Gain: 12.9dB; Noise Figure: 0.8dB; RF Type: Cellular, ISM, PCS; Voltage - Supply: 3 V ~ 5 V; Current - Supply: 46mA; Test Frequency: 1.9GHz; Supplier 1: Digi-Key; Manufacturer: RFMD; Manufacturer Part Number: SPF5043Z; RoHS: RoHS Compliant; Category: RF/IF and RFID; Stock 1: 12; Pricing 1: 1=2.73, 10=2.47, 25=2.2052, 100=1.9845 (USD); Packaging: Cut Tape (CT); Part Status: Discontinued at Digi-Key; Package / Case: SC-82A, SOT-343; Supplier Device Package: SOT-343; ComponentLink1URL: http://www.rfmd.com/store/downloads/dl/file/id/27713/spf5043z_data_sheet.pdf; ComponentLink1Description: http://www.rfmd.com/store/downloads/dl/file/id/27713/spf5043z_data_sheet.pdf; Supplier Part Number 1: 689-1101-1-ND
U9 U10 = SAW Filter: SAW Filter - Bandpass - TEMEX type
U11 = FAN2500S30X: IC REG LDO 3V 0.1A SOT23-5; Manufacturer: Fairchild Semiconductor; Regulator Topology: Positive Fixed; Current - Output: 100mA; Voltage - Dropout (Typical): 0.1V @ 100mA; Number of Regulators: 1; Voltage - Input: Up to 6.5V; Supplier 1: Digi-Key; Manufacturer Part Number: FAN2500S30X; RoHS: RoHS Compliant; Category: Integrated Circuits (ICs); Stock 1: 6000; Pricing 1: 3000=0.25462, 6000=0.23706, 15000=0.22828, 30000=0.2195, 75000=0.21599, 150000=0.21072 (USD); Packaging: Tape & Reel (TR); Voltage - Output: 3V; Current - Limit (Min): -; Operating Temperature: -40°C ~ 125°C; Mounting Type: Surface Mount; Package / Case: SC-74A, SOT-753; Supplier Device Package: SOT-23-5; ComponentLink1URL: http://www.fairchildsemi.com/ds/FA/FAN2500.pdf; ComponentLink1Description: http://www.fairchildsemi.com/ds/FA/FAN2500.pdf
X3 = ABM11-36.000MHZ-D2X-T3: CRYSTAL 36.0000MHZ 10PF SMD; Manufacturer: Abracon LLC; Frequency: 36MHz; Frequency Stability: ±20ppm; ESR (Equivalent Series Resistance): 80 Ohm; Operating Mode: Fundamental; Supplier 1: Digi-Key; Manufacturer Part Number: ABM11-36.000MHZ-D2X-T3; RoHS: RoHS Compliant; Category: Crystals, Oscillators, Resonators; Stock 1: 2790; Pricing 1: 1=1.36, 10=1.301, 50=1.2706, 100=1.089, 500=1.05876, 1000=0.89238 (USD); Packaging: Cut Tape (CT); Part Status: Discontinued at Digi-Key; Type: MHz Crystal; Frequency Tolerance: ±20ppm; Load Capacitance: 10pF; Operating Temperature: -40°C ~ 85°C; Ratings: -; Mounting Type: Surface Mount; Package / Case: 4-SMD, No Lead; Size / Dimension: 0.079" L x 0.063" W (2.00mm x 1.60mm); Height - Seated (Max): 0.023" (0.59mm); ComponentLink1URL: http://www.abracon.com/Resonators/ABM11.pdf; ComponentLink1Description: http://www.abracon.com/Resonators/ABM11.pdf; Supplier Part Number 1: 535-10947-1-ND
C62 C63 C67 C68 C86 C87 = C_DNP: Mounting Type: Surface Mount, MLCC; Applications: General Purpose; Package / Case: 0603 (1608 Metric)
C66 C83-C85 = C_TBD: Mounting Type: Surface Mount, MLCC; Applications: General Purpose; Package / Case: 0603 (1608 Metric)